# EAGLE design USB-interface-board (EAGLE 7.1.0)
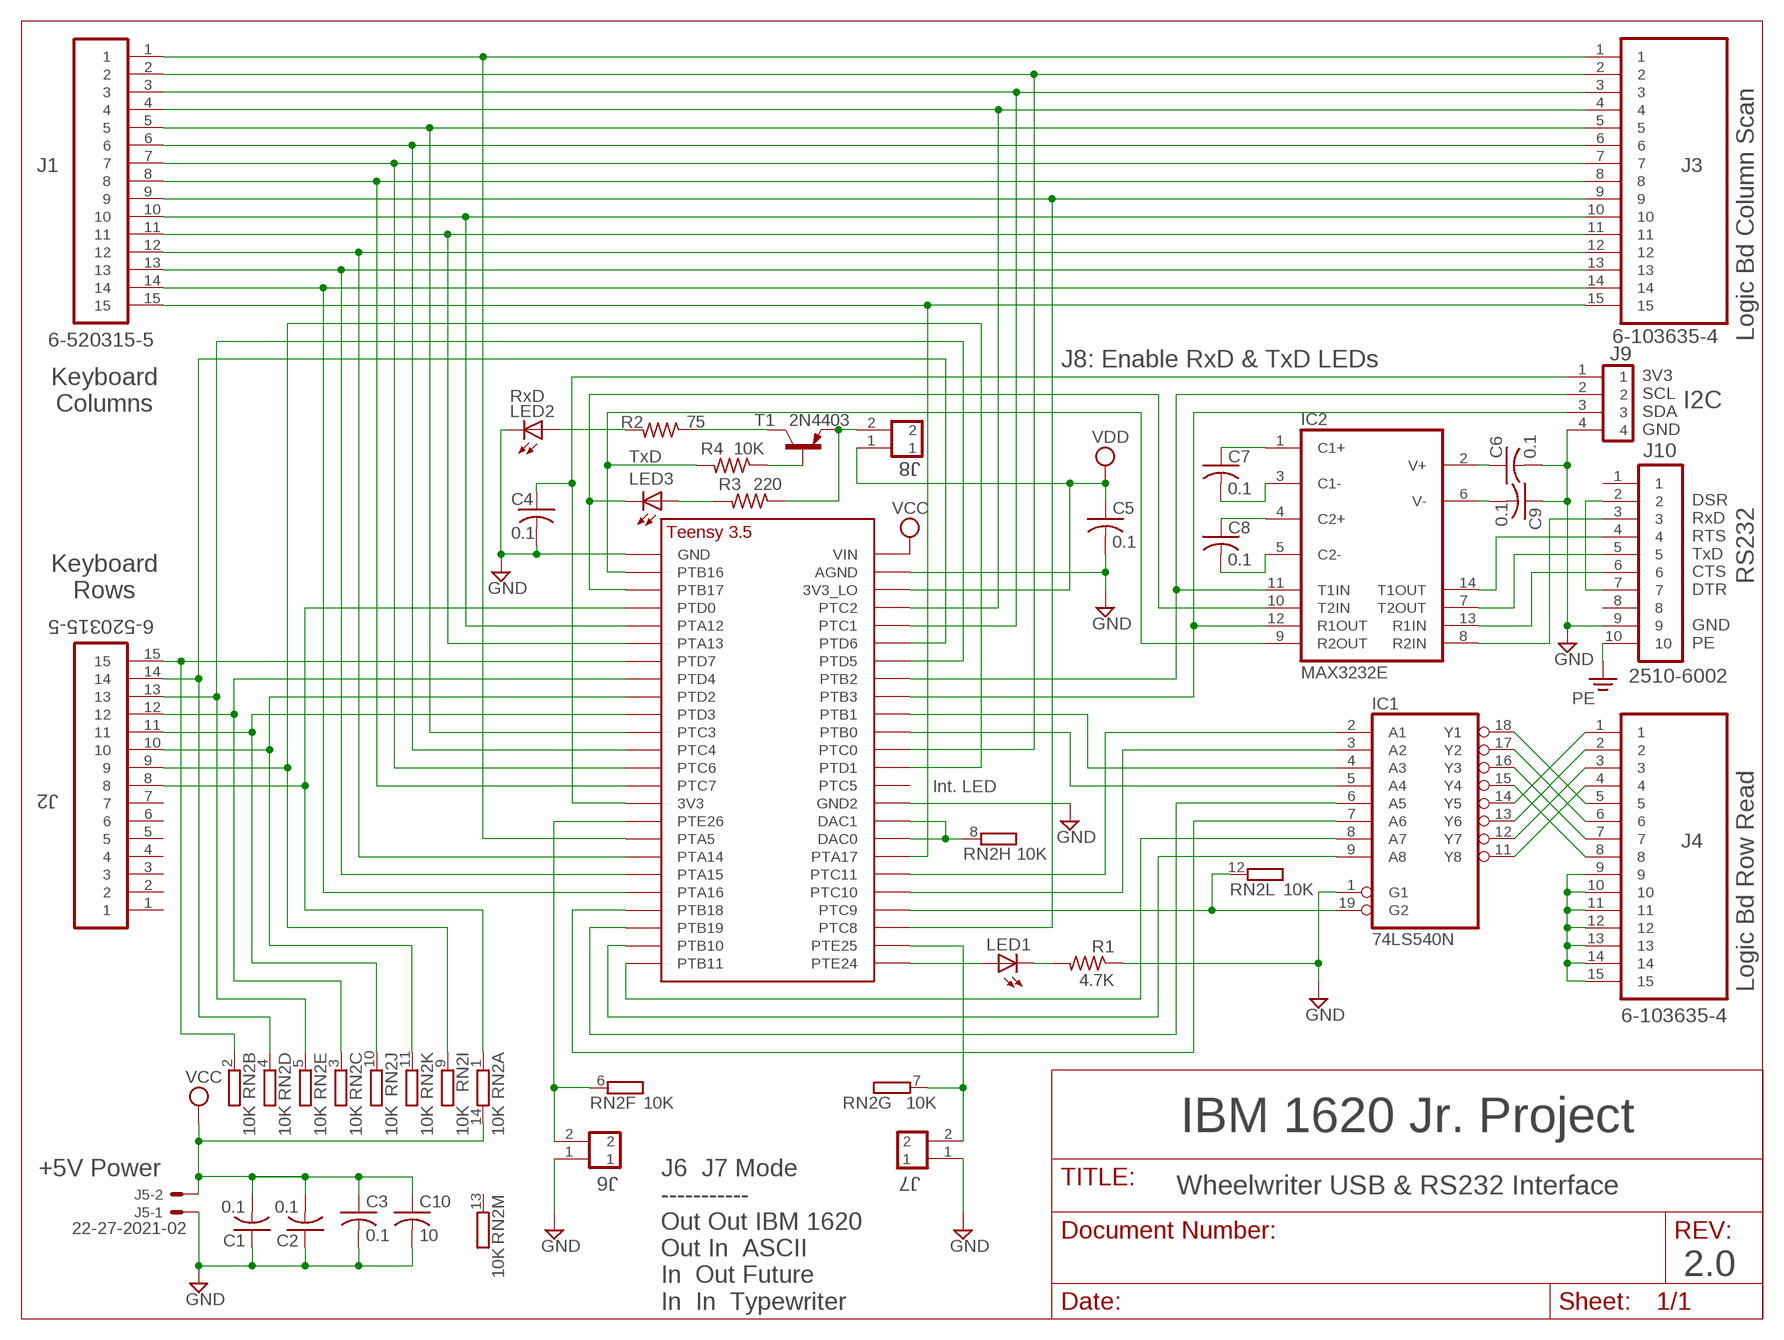
[diagram p0: schematic, sheet 1]

## Parts
C1  0.1  C-US025-025X050  [C025-025X050]
C2  0.1  C-US025-025X050  [C025-025X050]
C3  0.1  C-US025-025X050  [C025-025X050]
C4  0.1  C-US025-025X050  [C025-025X050]
C5  0.1  C-US025-025X050  [C025-025X050]
C6  0.1  C-US025-025X050  [C025-025X050]
C7  0.1  C-US025-025X050  [C025-025X050]
C8  0.1  C-US025-025X050  [C025-025X050]
C9  0.1  C-US025-025X050  [C025-025X050]
C10  10  C-US050-035X075  [C050-035X075]
IC1  74LS540N  [DIL20]
IC2  MAX3232E  MAX3232EPE  [DIL16]
J1  6-520315-5  TYCO-6-520315-5  [6-520315-5]
J2  6-520315-5  TYCO-6-520315-5U  [6-520315-5-U]
J3  6-103635-4  [6-103635-4]
J4  6-103635-4  [6-103635-4]
J5  22-27-2021-02  [6410-02]
J6  HEADER-1X2  [HEADER-1X2]
J7  HEADER-1X2  [HEADER-1X2]
J8  HEADER-1X2  [HEADER-1X2]
J9  HEADER-1X4  [HEADER-1X4]
J10  2510-6002  2510-  [PAK100/2500-10]
LED1  LED3MM  [LED3MM]
LED2  RxD  LED3MM  [LED3MM]
LED3  TxD  LED3MM  [LED3MM]
R1  4.7K  R-US_0204/5  [0204/5]
R2  75  R-US_0204/5  [0204/5]
R3  220  R-US_0204/5  [0204/5]
R4  10K  R-US_0204/5  [0204/5]
RN2  10K  E13R  [DIL14]
T1  2N4403  2N3906  [TO92]
U$1  TEENSY_3.5_BASIC  [TEENSY_3.5_BASIC]

## Nets
GND: C1.1 C2.1 C3.2 C4.2 C5.2 C6.2 C9.1 C10.2 IC1.1(G1) J5.1 J6.1 J7.1 J9.4 J10.9 LED2.K(C) R1.1 U$1.AGND U$1.GND U$1.GND2
N$1: J1.2 J3.2 U$1.PTC0
N$2: J1.3 J3.3 U$1.PTC1
N$3: J1.4 J3.4 U$1.PTC2
N$4: J1.5 J3.5 U$1.PTC3
N$5: J1.6 J3.6 U$1.PTC4
N$6: J1.7 J3.7 U$1.PTC6
N$7: J1.8 J3.8 U$1.PTC7
N$8: J1.9 J3.9 U$1.PTC8
N$9: J1.10 J3.10 U$1.PTA12
N$10: J1.11 J3.11 U$1.PTA13
N$11: J1.12 J3.12 U$1.PTA14
N$12: J1.13 J3.13 U$1.PTA15
N$13: J1.14 J3.14 U$1.PTA16
N$14: J1.15 J3.15 U$1.PTA17
N$15: J2.15 RN2.2 U$1.PTD7
N$16: J2.14 RN2.4 U$1.PTD6
N$17: J2.13 RN2.5 U$1.PTD5
N$18: J2.12 RN2.3 U$1.PTD4
N$19: J2.11 RN2.10 U$1.PTD3
N$20: J2.10 RN2.11 U$1.PTD2
N$21: J2.9 RN2.9 U$1.PTD1
N$22: J2.8 RN2.1 U$1.PTD0
N$23: IC1.11(Y8) J4.4
N$24: IC1.12(Y7) J4.3
N$25: IC1.13(Y6) J4.2
N$26: IC1.14(Y5) J4.1
N$27: IC1.15(Y4) J4.8
N$28: IC1.16(Y3) J4.7
N$29: IC1.17(Y2) J4.6
N$30: IC1.18(Y1) J4.5
N$31: J4.9 J4.10 J4.11 J4.12 J4.13 J4.14 J4.15
N$32: IC1.8(A7) U$1.PTB11
N$33: IC1.9(A8) U$1.PTB10
N$34: IC1.6(A5) U$1.PTB19
N$35: IC1.7(A6) U$1.PTB18
N$36: IC1.5(A4) U$1.PTB0
N$37: IC1.4(A3) U$1.PTB1
N$38: IC1.2(A1) U$1.PTC11
N$39: IC1.3(A2) U$1.PTC10
N$40: J6.2 RN2.6 U$1.PTE26
N$41: C6.1 IC2.2(V+)
N$42: LED1.K(C) R1.2
N$43: LED1.A U$1.PTE24
N$44: J7.2 RN2.7 U$1.PTE25
N$45: C9.2 IC2.6(V-)
N$46: IC2.14(T1OUT) J10.4
N$47: C4.1 J9.1 U$1.3V3
N$48: IC2.12(R1OUT) J9.3 U$1.PTB3
N$49: C7.1 IC2.1(C1+)
N$50: J10.2 J10.7
N$51: IC1.19(G2) RN2.12 U$1.PTC9
N$52: J1.1 J3.1 U$1.PTA5
N$53: C7.2 IC2.3(C1-)
N$54: C8.1 IC2.4(C2+)
N$55: C8.2 IC2.5(C2-)
N$56: IC2.11(T1IN) J9.2 U$1.PTB2
N$57: IC2.9(R2OUT) R4.2 U$1.PTB16
N$58: IC2.10(T2IN) LED3.K(C) U$1.PTB17
N$59: IC2.7(T2OUT) J10.5
N$60: IC2.8(R2IN) J10.3
N$61: IC2.13(R1IN) J10.6
N$62: R2.1 T1.1(C)
N$63: LED3.A R3.2
N$64: LED2.A R2.2
N$65: RN2.8 U$1.DAC0 U$1.DAC1
N$66: J8.2 R3.1 T1.3(E)
N$68: R4.1 T1.2(B)
PE: J10.10
VCC: C1.2 C2.2 C3.1 C10.1 J5.2 RN2.14 U$1.VIN
VDD: C5.1 J8.1 U$1.3V3_LO
Unconnected: J2.1 J2.2 J2.3 J2.4 J2.5 J2.6 J2.7 J10.1 J10.8 RN2.13 U$1.PTC5

## Notes on the sheet
- Logic Bd Column Scan
- Keyboard
  Columns
- J8: Enable RxD & TxD LEDs
- 3V3
  SCL
  SDA
  GND
- I2C
- DSR
  RxD
  RTS
  TxD
  CTS
  DTR
  
  GND
  PE
- RS232
- Keyboard
  Rows
- Int. LED
- Logic Bd Row Read
- IBM 1620 Jr. Project
- J6  J7 Mode
  -----------
  Out Out IBM 1620
  Out In  ASCII
  In  Out Future
  In  In  Typewriter
- +5V Power
- Wheelwriter USB & RS232 Interface
- 2.0

## Power pins joined to a net without a drawn wire
GND: IC1.10(GND) IC2.15(GND)
VCC: IC1.20(VCC)
VDD: IC2.16(VDD)

## Library data of the parts
C1-C10 = Casner:C-US: CAPACITOR, American symbol
IC1 = 74xx-us:74*540: Octal BUFFER and LINE DRIVER, 3-state
IC2 = Casner:MAX3232*: True RS-232 Transceivers 3.0V to 5.5V, Low-Power up to 1Mbps, Using Four 0.1µF External Capacitors Source: http://pdfserv.maxim-ic.com/en/ds/MAX3222-MAX3241.pdf; MPN: MAX3232EPE+; OC_FARNELL: unknown; OC_NEWARK: 67K4860
J1 J2 = Casner:TYCO-6-520315-5: FFC Connector, Vertical, 2.54MM, PCB, 1X15WAY
J3 J4 = Casner:6-103635-4: FFC Crimp Conn, Right Angle, 2.54MM, PCB, 1X15WAY
J5 = con-molex:22-?-02: CONNECTOR wire to board 2.54 mm (.1 inch) pitch header; OC_FARNELL: unknown; OC_NEWARK: unknown
J6-J8 = Casner:HEADER-1X2: CONN HEADER, 2.54MM, PCB, 1X2WAY; MPN: BBS-102-T-A; OC_FARNELL: 1766136; OC_NEWARK: -; PACKAGE: HEADER, 2.54MM, PCB, 1X2WAY; SUPPLIER: SAMTEC
J9 = Casner:HEADER-1X4: CONN HEADER, 2.54MM, PCB, 1X4WAY; MPN: BBS-104-T-A; PACKAGE: HEADER, 2.54MM, PCB, 1X4WAY; SUPPLIER: SAMTEC
J10 = Casner:2510-: 3M (TM) Pak 100 4-Wall Header Source: 3M; MF: 3M; MPN: 2510-6002UB; OC_FARNELL: 9838244; OC_NEWARK: 46F4725
LED1-LED3 = Casner:LED: LED OSRAM: - CHIPLED LG R971, LG N971, LY N971, LG Q971, LY Q971, LO R971, LY R971 LH N974, LH R974 LS Q976, LO Q976, LY Q976 LO Q996 - Hyper CHIPLED LW Q18S LB Q993, LB Q99A, LB R99A - SideLED LS A670, LO A670, LY A670, LG A670, LP A670 LB A673, LV A673, LT A673, LW A673 LH A674 LY A675 LS A676, LA A676, LO A676, LY A676, LW A676 LS A679, LY A679, LG A679 - Hyper Micro SIDELED® LS Y876, LA Y876, LO Y876, LY Y876 LT Y87S - SmartLED LW L88C, LW L88S LB L89C, LB L89S, LG L890 LS L89K, LO L89K, LY L89K LS L896, LA L896, LO L896, LY L896 - TOPLED LS T670, LO T670, LY T670, LG T670, LP T670 LSG T670, LSP T670, LSY T670, LOP T670, LYG T670 LG T671, LOG T671, LSG T671 LB T673, LV T673, LT T673, LW T673 LH T674 LS T676, LA T676, LO T676, LY T676, LB T676, LH T676, LSB T676, LW T676 LB T67C, LV T67C, LT T67C, LS T67K, LO T67K, LY T67K, LW E67C LS E67B, LA E67B, LO E67B, LY E67B, LB E67C, LV E67C, LT E67C LW T67C LS T679, LY T679, LG T679 LS T770, LO T770, LY T770, LG T770, LP T770 LB T773, LV T773, LT T773, LW T773 LH T774 LS E675, LA E675, LY E675, LS T675 LS T776, LA T776, LO T776, LY T776, LB T776 LHGB T686 LT T68C, LB T68C - Hyper Mini TOPLED® LB M676 - Mini TOPLED Santana® LG M470 LS M47K, LO M47K, LY M47K Source: http://www.osram.convergy.de LUXEON: - LUMILED® LXK2-PW12-R00, LXK2-PW12-S00, LXK2-PW14-U00, LXK2-PW14-V00 LXK2-PM12-R00, LXK2-PM12-S00, LXK2-PM14-U00 LXK2-PE12-Q00, LXK2-PE12-R00, LXK2-PE12-S00, LXK2-PE14-T00, LXK2-PE14-U00 LXK2-PB12-K00, LXK2-PB12-L00, LXK2-PB12-M00, LXK2-PB14-N00, LXK2-PB14-P00, LXK2-PB14-Q00 LXK2-PR12-L00, LXK2-PR12-M00, LXK2-PR14-Q00, LXK2-PR14-R00 LXK2-PD12-Q00, LXK2-PD12-R00, LXK2-PD12-S00 LXK2-PH12-R00, LXK2-PH12-S00 LXK2-PL12-P00, LXK2-PL12-Q00, LXK2-PL12-R00 Source: www.luxeon.com KINGBRIGHT: KA-3528ASYC Source: www.kingbright.com
R1-R4 = Casner:R-US_: RESISTOR, American symbol
RN2 = resistor-dil:E13R: DIL RESISTOR; OC_FARNELL: unknown; OC_NEWARK: unknown
T1 = transistor-pnp:2N3906: PNP Transistor
U$1 = Teensy35:TEENSY_3.5_BASIC

## Board
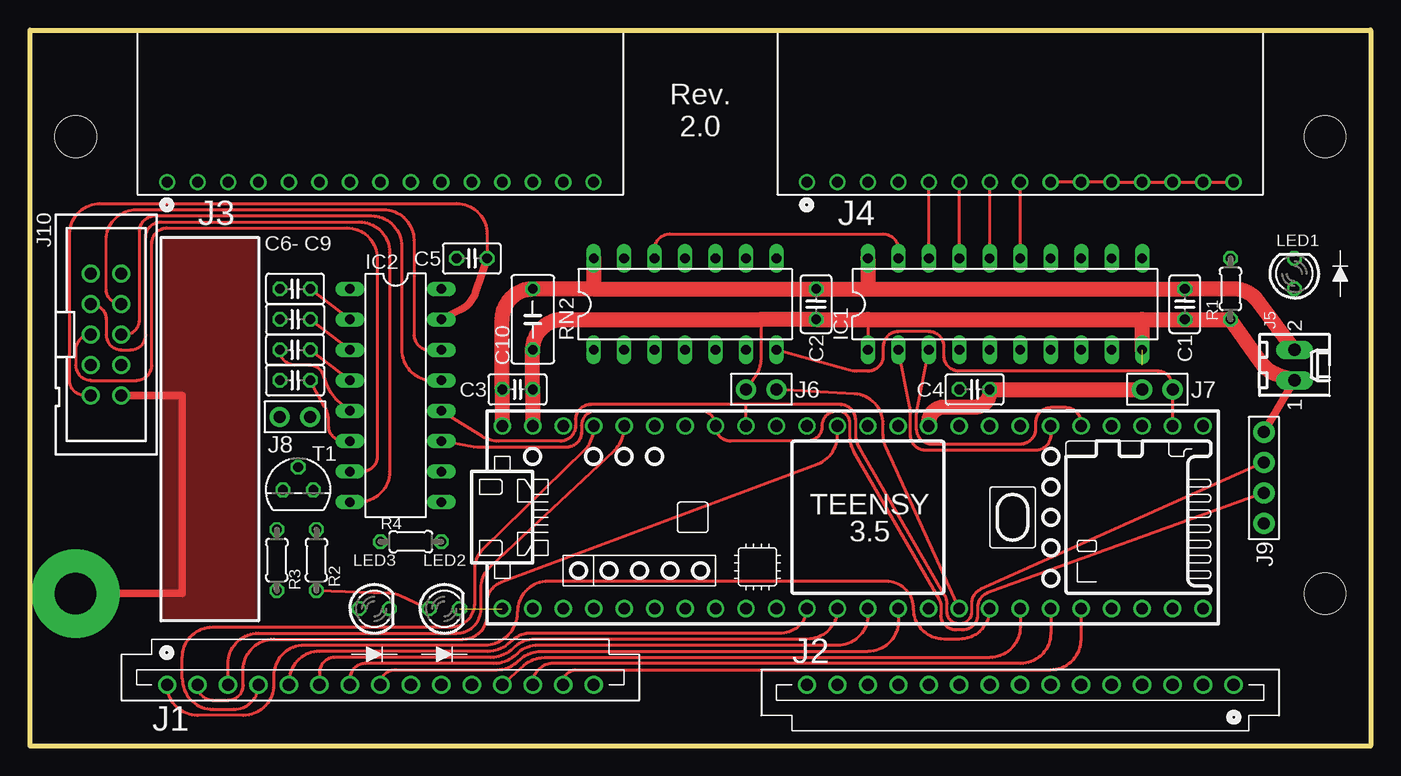
[diagram p1: board, top side]
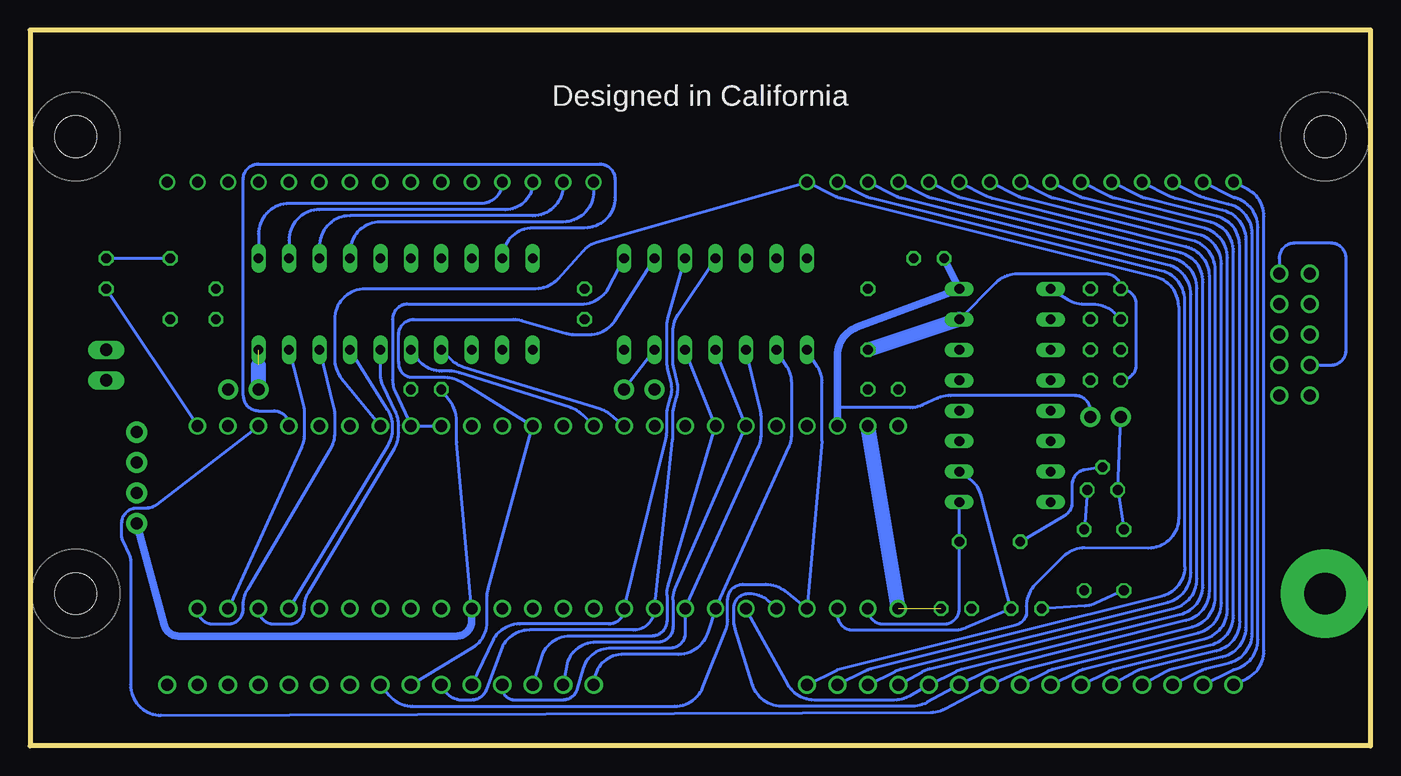
[diagram p2: board, bottom side, seen from below]

Size 111.76 x 59.69 mm. Coordinates in mm from the lower left corner, seen from the top.
Outline: 0,0 0,59.69 111.76,59.69 111.76,0 0,0
Copper layers (1*16): Top 0.0356mm / dielectric 1.5011mm / Bottom 0.0356mm
Design rules "oshpark-2layer": minimum track width 6mil, minimum drill 13mil, track to track 6mil, track to pad 6mil, pad to pad 6mil, via to via 6mil, smd to smd 6mil, copper to edge 15mil, drill to drill 6mil, minimum pad ring 7mil, minimum via ring 7mil, stop-mask expansion 2.5mil, vias tented up to drill 0mil, thermal gap 10mil

### Footprints (pad centres in the part's own frame; a part is rotated, then mirrored left to right if it is on the bottom)
C025-025X050 = drill 0.813 octagon: 1 -1.27,0; 2 1.27,0
C050-035X075 = drill 0.813 octagon: 1 -2.54,0; 2 2.54,0
DIL20 = drill 0.813 long: 1 -11.43,-3.81; 2 -8.89,-3.81; 3 -6.35,-3.81; 4 -3.81,-3.81; 5 -1.27,-3.81; 6 1.27,-3.81; 7 3.81,-3.81; 8 6.35,-3.81; 9 8.89,-3.81; 10 11.43,-3.81; 11 11.43,3.81; 12 8.89,3.81; 13 6.35,3.81; 14 3.81,3.81; 15 1.27,3.81; 16 -1.27,3.81; 17 -3.81,3.81; 18 -6.35,3.81; 19 -8.89,3.81; 20 -11.43,3.81
DIL16 = drill 0.813 long: 1 -8.89,-3.81; 2 -6.35,-3.81; 3 -3.81,-3.81; 4 -1.27,-3.81; 5 1.27,-3.81; 6 3.81,-3.81; 7 6.35,-3.81; 8 8.89,-3.81; 9 8.89,3.81; 10 6.35,3.81; 11 3.81,3.81; 12 1.27,3.81; 13 -1.27,3.81; 14 -3.81,3.81; 15 -6.35,3.81; 16 -8.89,3.81
6-520315-5 = drill 1.016: 1 0,0; 2 2.54,0; 3 5.08,0; 4 7.62,0; 5 10.16,0; 6 12.7,0; 7 15.24,0; 8 17.78,0; 9 20.32,0; 10 22.86,0; 11 25.4,0; 12 27.94,0; 13 30.48,0; 14 33.02,0; 15 35.56,0
6-520315-5-U = drill 1.016: 1 0,0; 2 2.54,0; 3 5.08,0; 4 7.62,0; 5 10.16,0; 6 12.7,0; 7 15.24,0; 8 17.78,0; 9 20.32,0; 10 22.86,0; 11 25.4,0; 12 27.94,0; 13 30.48,0; 14 33.02,0; 15 35.56,0
6-103635-4 = drill 0.9: 1 0,0; 2 2.54,0; 3 5.08,0; 4 7.62,0; 5 10.16,0; 6 12.7,0; 7 15.24,0; 8 17.78,0; 9 20.32,0; 10 22.86,0; 11 25.4,0; 12 27.94,0; 13 30.48,0; 14 33.02,0; 15 35.56,0
6410-02 = drill 1.016 long: 1 1.27,0; 2 -1.27,0
HEADER-1X2 = drill 1 pad 1.676: 1 0,0; 2 2.54,0
HEADER-1X4 = drill 1 pad 1.778: 1 0,0; 2 2.54,0; 3 5.08,0; 4 7.62,0
PAK100/2500-10 = drill 1 pad 1.422: 1 -5.08,-1.27; 2 -5.08,1.27; 3 -2.54,-1.27; 4 -2.54,1.27; 5 0,-1.27; 6 0,1.27; 7 2.54,-1.27; 8 2.54,1.27; 9 5.08,-1.27; 10 5.08,1.27
LED3MM = drill 0.813 octagon: A -1.27,0; K 1.27,0
0204/5 = drill 0.813 octagon: 1 -2.54,0; 2 2.54,0
DIL14 = drill 0.813 long: 1 -7.62,-3.81; 2 -5.08,-3.81; 3 -2.54,-3.81; 4 0,-3.81; 5 2.54,-3.81; 6 5.08,-3.81; 7 7.62,-3.81; 8 7.62,3.81; 9 5.08,3.81; 10 2.54,3.81; 11 0,3.81; 12 -2.54,3.81; 13 -5.08,3.81; 14 -7.62,3.81
TO92 = drill 0.813 octagon: 1 1.27,0; 2 0,1.905; 3 -1.27,0
TEENSY_3.5_BASIC = drill 0.965: 3V3 7.62,-7.62; 3V3_LO -22.86,7.62; AGND -25.4,7.62; DAC0 12.7,7.62; DAC1 10.16,7.62; GND -27.94,-7.62; GND2 7.62,7.62; PTA5 12.7,-7.62; PTA12 -17.78,-7.62; PTA13 -15.24,-7.62; PTA14 15.24,-7.62; PTA15 17.78,-7.62; PTA16 20.32,-7.62; PTA17 15.24,7.62; PTB0 -2.54,7.62; PTB1 -5.08,7.62; PTB2 -10.16,7.62; PTB3 -7.62,7.62; PTB10 27.94,-7.62; PTB11 30.48,-7.62; PTB16 -25.4,-7.62; PTB17 -22.86,-7.62; PTB18 22.86,-7.62; PTB19 25.4,-7.62; PTC0 0,7.62; PTC1 -17.78,7.62; PTC2 -20.32,7.62; PTC3 -2.54,-7.62; PTC4 0,-7.62; PTC5 5.08,7.62; PTC6 2.54,-7.62; PTC7 5.08,-7.62; PTC8 25.4,7.62; PTC9 22.86,7.62; PTC10 20.32,7.62; PTC11 17.78,7.62; PTD0 -20.32,-7.62; PTD1 2.54,7.62; PTD2 -7.62,-7.62; PTD3 -5.08,-7.62; PTD4 -10.16,-7.62; PTD5 -12.7,7.62; PTD6 -15.24,7.62; PTD7 -12.7,-7.62; PTE24 30.48,7.62; PTE25 27.94,7.62; PTE26 10.16,-7.62; VIN -27.94,7.62
MOUNTING_HOLE = hole 3.454: 0,0

### Placement (x,y rotation side)
C1  96.27,36.83 90 top
C2  65.53,36.83 90 top
C3  40.64,29.72 0 top
C4  78.74,29.72 0 top
C5  36.83,40.64 0 top
C6  22.1,38.1 180 top
C7  22.1,35.56 0 top
C8  22.1,33.02 180 top
C9  22.1,30.48 0 top
C10  41.91,35.56 270 top
IC1  81.28,36.83 0 top
IC2  30.48,29.21 270 top
J1  11.43,5.08 0 top
J2  100.33,5.08 180 top
J3  11.43,46.99 0 top
J4  64.77,46.99 0 top
J5  105.41,31.75 270 top
J6  59.69,29.72 0 top
J7  92.71,29.72 0 top
J8  23.37,27.43 180 top
J9  102.87,18.54 90 top
J10  6.35,34.29 270 top
LED1  105.41,39.37 90 top
LED2  34.54,11.43 0 top
LED3  28.7,11.43 0 top
R1  100.08,38.1 90 top
R2  23.88,15.49 270 top
R3  20.57,15.49 270 top
R4  31.75,17.02 0 top
RN2  54.61,36.83 0 top
T1  22.35,21.34 0 top
U$1  67.31,19.05 0 top
U$2  [MOUNTING_HOLE]  3.81,50.8 0 top
U$4  [MOUNTING_HOLE]  107.95,50.8 0 top
U$5  [MOUNTING_HOLE]  107.95,12.7 0 top

### Tracks (layer width: path | path; a pad name or v marks a point on that pad's centre or on a via)
GND  (2 unrouted)
  Top 0.254: J6.1 60.49,30.83 arc36 60.96,32.31 60.96,35.56 | J10.9 4.57,29.21 arc-90 3.3,30.48 3.3,42.67 arc-90 5.84,45.21 35.56,45.21 arc-90 38.1,42.67 C5.2 | 69.85,35.56 IC1.1
  Top 0.61: J5.1 J9.4 | C5.2 37.16,37.83 arc-45 35.89,36.36 IC2.15
  Top 1.27: 92.71,35.56 69.85,35.56 C2.1 60.96,35.56 44.45,35.56 arc90 C10.2 C3.2 U$1.AGND | 92.71,35.56 C1.1 R1.1 102.64,31.92 arc36 103.91,30.98 J5.1 | IC1.10 92.71,35.56 | J7.1 C4.2 80.01,29.52 arc-90 78.74,28.25 76.2,28.25 arc90 74.93,26.98 U$1.GND2
  Bottom 0.254: IC2.15 31.22,38.63 arc45 29.43,39.37 22.1,39.37 arc90 C6.2 arc90 19.56,36.83 19.56,31.75 arc90 C9.1
  Bottom 1.27: U$1.GND U$1.AGND | J7.1 92.71,31.75 | IC2.15 C10.2
N$1
  Top 0.254: J1.2 arc90 15.24,3.81 16.51,3.81 arc90 17.78,5.08 17.78,6.35 arc-90 20.32,8.89 36.1,8.89 arc95 38.1,11.05 38.1,12.13 arc-66 39.4,13.69 65.66,23.51 arc69 67.31,25.89 U$1.PTC0
  Bottom 0.254: J1.2 11.53,6.3 arc13 11.32,6.38 arc-76 9.4,8.84 9.4,43.23 arc-76 11.32,45.69 arc13 11.53,45.77 J3.2
N$2
  Top 0.254: J1.3 16.51,6.86 arc-90 19.05,9.4 35.59,9.4 arc90 37.59,11.4 37.59,13.12 arc-47 38.4,14.98 48.73,24.65 arc47 49.53,26.5 U$1.PTC1
  Bottom 0.254: J3.3 14.22,45.84 arc-13 13.7,45.65 11.83,45.19 arc76 9.91,42.72 9.91,9.35 arc76 11.83,6.88 13.7,6.42 arc-13 14.22,6.22 J1.3
N$3
  Top 0.254: J1.4 arc-90 17.02,3.05 15.24,3.05 arc-90 12.7,5.59 12.7,7.37 arc-90 15.24,9.91 35.08,9.91 arc90 37.08,11.91 37.08,14.68 arc-46 37.85,16.5 46.22,24.65 arc46 46.99,26.47 U$1.PTC2
  Bottom 0.254: J3.4 16.76,45.84 arc-13 16.24,45.65 12.34,44.68 arc76 10.41,42.21 10.41,9.88 arc77 12.36,7.41 16.43,6.43 arc-16 17.07,6.18 J1.4
N$4
  Top 0.254: U$1.PTC3 arc-90 62.48,9.4 41.83,9.4 arc41 40.18,8.79 39.83,8.48 arc-41 38.18,7.87 24.13,7.87 arc90 21.59,5.33 J1.5
  Bottom 0.254: J3.5 19.3,45.84 arc-13 18.78,45.65 12.85,44.17 arc76 10.92,41.7 10.92,10.38 arc76 12.86,7.91 18.97,6.43 arc-15 19.61,6.18 J1.5
N$5
  Top 0.254: U$1.PTC4 arc-90 64.77,8.89 42.09,8.89 arc41 40.43,8.28 40.08,7.98 arc-41 38.43,7.37 25.4,7.37 arc90 24.13,6.1 J1.6
  Bottom 0.254: J1.6 21.84,6.22 arc13 21.32,6.42 13.35,8.41 arc-76 11.43,10.87 11.43,41.2 arc-76 13.35,43.66 21.32,45.65 arc13 21.84,45.84 J3.6
N$6
  Top 0.254: U$1.PTC6 69.85,10.92 arc-90 67.31,8.38 42.34,8.38 arc41 40.69,7.77 40.34,7.47 arc-41 38.68,6.86 27.94,6.86 arc90 26.67,5.59 J1.7
  Bottom 0.254: J1.7 24.38,6.22 arc13 23.86,6.42 13.86,8.92 arc-76 11.94,11.38 11.94,40.69 arc-76 13.86,43.15 23.86,45.65 arc13 24.38,45.84 J3.7
N$7
  Top 0.254: U$1.PTC7 72.39,10.41 arc-90 69.85,7.87 42.6,7.87 arc41 40.94,7.26 40.59,6.96 arc-41 38.94,6.35 30.48,6.35 arc90 J1.8
  Bottom 0.254: J1.8 26.92,6.22 arc13 26.4,6.42 14.37,9.43 arc-76 12.45,11.89 12.45,40.18 arc-76 14.37,42.65 26.4,45.65 arc13 26.92,45.84 J3.8
N$8
  Bottom 0.254: J3.9 29.46,45.84 arc-13 28.94,45.65 14.88,42.14 arc76 12.95,39.67 12.95,12.39 arc76 14.87,9.93 28.74,6.41 arc-10 29.16,6.26 J1.9 35.48,3.09 arc28 36.67,2.79 100.83,2.55 arc90 103.38,5.09 103.38,15.45 arc-27 103.51,16.02 104.01,17 arc27 104.14,17.57 104.14,18.54 arc90 102.87,19.81 102.03,19.81 arc-38 101.26,20.08 U$1.PTC8
N$9
  Bottom 0.254: J3.10 32,45.84 arc-13 31.48,45.65 15.39,41.63 arc76 13.46,39.16 13.46,12.9 arc76 15.39,10.44 31.48,6.42 arc-13 32,6.22 J1.10 36.98,3.61 arc29 38.2,3.3 49.1,3.3 arc73 51.53,5.09 52.97,9.79 arc17 53.09,10.54 53.09,11.47 arc90 51.85,12.7 arc45 50.06,11.96 U$1.PTA12
N$10
  Bottom 0.254: J3.11 34.54,45.84 arc-13 34.02,45.65 15.89,41.12 arc76 13.97,38.66 13.97,13.41 arc76 15.89,10.95 34.02,6.42 arc-13 34.54,6.22 J1.11 38.47,4.14 arc30 39.73,3.81 46.37,3.81 arc61 48.59,5.12 U$1.PTA13
N$11
  Top 0.254: U$1.PTA14 82.55,9.91 arc-90 80.01,7.37 42.88,7.37 arc42 41.19,6.71 J1.12
  Bottom 0.254: J1.12 37.38,6.19 arc15 36.76,6.43 16.41,11.46 arc-76 14.48,13.93 14.48,38.15 arc-76 16.4,40.61 36.56,45.65 arc13 37.08,45.84 J3.12
N$12
  Top 0.254: U$1.PTA15 85.09,9.4 arc-90 82.55,6.86 43.43,6.86 arc90 J1.13
  Bottom 0.254: J1.13 39.62,6.22 arc13 39.1,6.42 16.91,11.96 arc-76 14.99,14.43 14.99,37.64 arc-76 16.91,40.1 39.1,45.65 arc13 39.62,45.84 J3.13
N$13
  Top 0.254: J1.14 arc-90 45.47,6.35 85.09,6.35 arc90 87.63,8.89 U$1.PTA16
  Bottom 0.254: J3.14 42.16,45.84 arc-13 41.64,45.65 17.42,39.6 arc76 15.49,37.13 15.49,14.94 arc76 17.42,12.47 41.64,6.42 arc-13 42.16,6.22 J1.14
N$14
  Bottom 0.254: J1.15 44.45,6.35 29.61,10.06 arc-59 28.7,10.92 28.7,11.65 arc45 27.96,13.44 25.64,15.76 arc45 23.83,16.5 18.56,16.48 arc-90 16,19.02 16,36.62 arc-76 17.93,39.09 44.18,45.65 arc13 44.7,45.84 J3.15 64.53,42 arc-29 65.61,41.29 67.75,38.93 arc48 69.63,38.1 83.82,38.1 arc-90 86.36,35.56 86.36,32.23 arc-39 85.79,30.62 U$1.PTA17
N$15
  Bottom 0.254: J2.15 64.62,5.95 arc70 62.49,7.62 57.71,7.62 arc-72 55.3,9.36 U$1.PTD7 48.49,24.9 arc-24 48.26,25.95 48.26,30.26 arc-32 48.65,31.61 RN2.2
N$16
  Bottom 0.254: J2.14 66.94,7.05 arc68 64.58,8.64 59.44,8.64 arc-90 58.17,9.91 58.17,12.17 arc24 57.95,13.19 U$1.PTD6 RN2.4
N$17
  Bottom 0.254: J2.13 69.02,7.7 arc64 66.73,9.14 59.94,9.14 arc-90 58.67,10.41 58.67,12.59 arc17 58.57,13.31 U$1.PTD5 RN2.5
N$18
  Bottom 0.254: J2.12 72.26,4.38 arc-56 71.45,3.81 67.36,3.81 arc-74 66.14,4.73 65.64,6.48 arc69 63.52,8.13 58.42,8.13 arc-90 57.15,9.4 U$1.PTD4 51.03,24.9 arc-24 50.8,25.95 50.8,27.39 arc-13 50.87,27.98 RN2.3
N$19
  Bottom 0.254: J2.11 73.12,8.9 arc60 70.93,10.16 63.5,10.16 arc-90 U$1.PTD3 58.75,25.61 arc-14 58.67,26.21 58.67,27.58 arc16 58.58,28.28 58.35,29.06 arc-30 58.33,30.38 58.6,31.45 arc14 58.67,32.06 58.67,34.95 arc16 58.58,35.65 RN2.10
N$20
  Bottom 0.254: J2.10 arc-56 76,3.81 74.94,3.81 arc-69 73.75,4.63 72.35,8.33 arc61 70.12,9.65 61.47,9.65 arc-90 U$1.PTD2 58.18,25.52 arc-6 58.17,25.79 58.17,27.58 arc16 58.07,28.28 57.84,29.06 arc-30 57.82,30.38 58.09,31.45 arc14 58.17,32.06 58.17,34.54 arc34 57.74,35.95 RN2.11
N$21
  Bottom 0.254: RN2.9 63,35.46 arc57 65.14,34.29 66.32,34.29 arc16 67.02,34.39 70.78,35.46 arc-16 71.48,35.56 79.76,35.56 arc-90 81.03,34.29 81.03,32 arc-90 80.01,30.73 77.17,30.73 arc32 75.84,30.36 U$1.PTD1 73.57,13.03 arc-15 73.66,12.36 73.66,10.33 arc59 74.89,8.15 J2.9
N$22
  Bottom 0.254: J2.8 81.8,4.2 arc-50 79.87,3.3 58.02,3.3 arc-68 55.66,4.9 53.71,9.79 arc-17 53.59,10.54 53.59,12.19 arc90 52.32,13.46 50.42,13.46 arc39 48.83,12.9 U$1.PTD0 45.72,25.4 45.72,30.26 arc-32 46.11,31.61 RN2.1
N$23
  Bottom 0.254: J4.4 arc90 74.17,45.21 90.17,45.21 arc-90 92.71,42.67 IC1.11
N$24
  Bottom 0.254: J4.3 arc90 72.14,44.7 87.63,44.7 arc-90 90.17,42.16 IC1.12
N$25
  Bottom 0.254: J4.2 67.31,46.74 arc90 69.85,44.2 85.09,44.2 arc-90 87.63,41.66 IC1.13
N$26
  Bottom 0.254: J4.1 64.77,46.23 arc90 67.31,43.69 82.55,43.69 arc-90 85.09,41.15 IC1.14
N$27
  Top 0.254: IC1.15 J4.8
N$28
  Top 0.254: IC1.16 J4.7
N$29
  Top 0.254: IC1.17 J4.6
N$30
  Top 0.254: IC1.18 J4.5
N$31
  Top 0.254: J4.9 J4.10 J4.11 J4.12 J4.13 J4.14 J4.15
N$32
  Bottom 0.254: U$1.PTB11 arc-90 96.52,10.16 95.25,10.16 arc-90 93.98,11.43 93.98,11.75 arc30 93.63,13.04 86.71,24.8 arc-30 86.36,26.09 86.36,27.57 arc-14 86.43,28.18 IC1.8
N$33
  Bottom 0.254: U$1.PTB10 89.13,24.9 arc-24 88.9,25.95 88.9,27.81 arc-15 88.98,28.45 IC1.9
N$34
  Bottom 0.254: U$1.PTB19 arc-90 91.44,10.16 90.17,10.16 arc-90 88.9,11.43 88.9,11.49 arc31 88.54,12.79 81.38,24.8 arc-31 81.03,26.1 81.03,26.74 arc-26 81.28,27.84 82.3,29.96 arc26 82.55,31.06 IC1.6
N$35
  Bottom 0.254: U$1.PTB18 81.9,25.05 arc-31 81.53,26.36 81.53,26.66 arc-32 81.93,28.02 IC1.7
N$36
  Bottom 0.254: U$1.PTB0 65.68,27.58 arc-28 66.71,28.2 76.01,31.12 arc-17 76.77,31.24 77.43,31.24 arc54 79.5,32.31 IC1.5
N$37
  Bottom 0.254: U$1.PTB1 63.36,27.61 arc-23 64.24,28.09 75.59,31.57 arc28 76.65,32.2 IC1.4
N$38
  Top 0.254: U$1.PTC11 85.09,25.91 arc-90 83.82,24.64 74.68,24.64 arc-90 73.41,25.91 73.41,27.69 arc11 73.36,28.19 IC1.2
N$39
  Top 0.254: U$1.PTC10 87.63,26.92 arc90 86.36,28.19 85.09,28.19 arc90 83.82,26.92 83.82,26.42 arc-90 82.55,25.15 75.18,25.15 arc-90 73.91,26.42 73.91,27.69 arc-11 73.96,28.19 IC1.3
N$40
  Top 0.254: U$1.PTE26 71.35,24.9 arc-24 71.12,25.95 71.12,26.81 arc87 68.73,29.35 J6.2
  Bottom 0.254: RN2.6 J6.2
N$41
  Top 0.254: C6.1 IC2.2
N$42
  Bottom 0.254: R1.2 LED1.K
N$43
  Bottom 0.254: U$1.PTE24 LED1.A
N$44
  Top 0.254: U$1.PTE25 J7.2 95.25,29.97 arc90 93.98,31.24 77.47,31.24 arc-90 76.2,32.51 76.2,33.27 arc90 74.93,34.54 72.39,34.54 arc90 71.12,33.27 71.12,32.51 arc-90 69.85,31.24 68.93,31.24 arc-16 68.24,31.34 RN2.7
N$45
  Top 0.254: IC2.6 26.16,25.4 arc-90 24.89,26.67 24.89,27.04 arc29 24.58,28.25 C9.2
N$46
  Top 0.254: J10.4 arc-90 6.35,38.1 6.35,42.16 arc-90 8.89,44.7 29.46,44.7 arc-90 32,42.16 32,34.29 arc90 33.27,33.02 IC2.14
N$47
  Bottom 0.254: U$1.3V3 76.19,25.29 arc5 76.2,25.52 76.2,27.13 arc-36 76.67,28.6 C4.1
  Bottom 0.61: U$1.3V3 74.93,10.41 arc90 76.2,9.14 99.36,9.14 arc75 100.58,10.08 J9.1
N$48
  Top 0.254: U$1.PTB3 59.69,28.45 | 59.69,28.45 46.74,28.45 arc90 45.47,27.18 45.47,26.67 arc-90 44.2,25.4 39.08,25.4 arc-32 37.74,25.79 IC2.12 | J9.3 79.24,13.04 arc66 78.49,11.88 78.49,11.16 arc-90 77.49,10.16 77.45,10.16 arc-90 76.45,11.16 76.45,11.85 arc30 76.28,12.49 69.17,24.81 arc-30 68.83,26.08 68.83,27.18 arc90 67.56,28.45 59.69,28.45
N$49
  Bottom 0.254: IC2.1 25.26,37.22 arc-32 23.91,36.83 23.15,36.83 arc45 21.35,36.09 C7.1
N$50
  Bottom 0.254: J10.7 3.3,31.75 arc-90 2.03,33.02 2.03,40.64 arc-90 3.3,41.91 6.35,41.91 arc-90 7.62,40.64 J10.2
N$51
  Top 0.254: RN2.12 52.07,41.4 arc-90 53.34,42.67 71.12,42.67 arc-90 72.39,41.4 IC1.19
  Bottom 0.254: U$1.PTC9 arc-90 91.44,27.94 92.71,27.94 arc90 93.98,29.21 93.98,47.24 arc90 92.71,48.51 64.26,48.51 arc90 62.99,47.24 62.99,45.72 arc90 65.53,43.18 69.85,43.18 arc-90 IC1.19
N$52
  Top 0.254: J1.1 arc90 13.97,2.54 17.78,2.54 arc90 20.32,5.08 20.32,5.84 arc-90 22.86,8.38 37.92,8.38 arc41 39.57,8.99 39.75,9.15 arc49 40.64,11.07 40.64,11.18 arc-90 43.18,13.72 71.37,13.72 arc-90 73.66,11.43 arc90 76.2,8.89 77.47,8.89 arc90 U$1.PTA5
  Bottom 0.254: J1.1 10.29,5.65 arc-63 8.89,7.92 8.89,44.15 arc-63 10.29,46.42 J3.1
N$53
  Top 0.254: C7.2 IC2.3
N$54
  Top 0.254: C8.1 IC2.4
N$55
  Top 0.254: IC2.5 25.64,28.8 arc-28 24.91,29.81 24.45,30.95 arc68 23.27,31.75 22.1,31.75 arc-90 C8.2
N$56
  Top 0.254: IC2.11 36.99,24.9 arc4 37.94,24.89 44.7,24.89 arc90 45.97,26.16 45.97,26.67 arc-90 47.24,27.94 55.88,27.94 arc-90 U$1.PTB2 arc90 58.42,25.4 64.77,25.4 arc90 66.04,26.67 arc-90 67.31,27.94 arc-90 68.33,26.92 68.33,25.83 arc30 68.67,24.56 75.78,12.23 arc-30 75.95,11.6 75.95,10.92 arc90 77.22,9.65 77.72,9.65 arc90 78.99,10.92 78.99,11.55 arc-70 79.83,12.75 J9.2
N$57
  Bottom 0.254: U$1.PTB16 arc-90 40.64,10.16 35.56,10.16 arc-90 34.29,11.43 R4.2 IC2.9
N$58
  Bottom 0.254: U$1.PTB17 44.45,10.92 arc-90 43.18,9.65 34.73,9.65 arc-23 33.75,9.85 LED3.K 32.37,20.48 arc-47 33.42,22.24 IC2.10
N$59
  Top 0.254: J10.5 arc90 3.81,33.02 3.81,31.75 arc90 5.08,30.48 8.89,30.48 arc90 10.16,31.75 10.16,41.91 arc-90 11.43,43.18 26.42,43.18 arc-90 28.96,40.64 28.96,24.13 arc-90 27.69,22.86 IC2.7
N$60
  Top 0.254: J10.3 arc-90 6.35,35.56 6.35,34.29 arc90 7.62,33.02 8.38,33.02 arc90 9.65,34.29 9.65,42.42 arc-90 10.92,43.69 27.43,43.69 arc-90 29.97,41.15 29.97,22.86 arc-90 27.43,20.32 IC2.8
N$61
  Top 0.254: J10.6 7.87,34.29 arc90 9.14,35.56 9.14,42.93 arc-90 10.41,44.2 28.45,44.2 arc-90 30.99,41.66 30.99,33.02 arc90 33.53,30.48 IC2.13
N$62
  Bottom 0.254: T1.1 R2.1
N$63
  Bottom 0.254: R3.2 22.94,11.88 arc21 23.84,11.65 LED3.A
N$64
  Top 0.254: R2.2 29.87,12.76 arc-23 30.84,12.54 LED2.A
N$65
  Bottom 0.254: RN2.8 63.55,38.17 arc62 65.79,36.83 80.26,36.83 arc-90 81.53,35.56 81.53,30.53 arc-25 81.3,29.46 U$1.DAC0 U$1.DAC1
N$66
  Bottom 0.254: R3.1 T1.3 J8.2
N$68
  Bottom 0.254: T1.2 23.81,23.02 arc-81 24.89,21.77 24.89,20.28 arc60 25.52,19.19 R4.1
PE  (via drill 3.45 pad 7.37)
  Top 0.61: J10.10 12.7,29.21 12.7,12.7 v3.81,12.7
  pour Top: 10.92,10.41 10.92,42.42 19.05,42.42 19.05,10.41
VCC
  Top 1.27: 69.85,38.1 C2.2 46.99,38.1 | 69.85,38.1 C1.2 100.33,38.1 arc-53 102.36,37.08 J5.2 | IC1.20 69.85,38.1 | RN2.14 46.99,38.1 | 46.99,38.1 C10.1 arc90 39.37,35.56 C3.1 U$1.VIN
VDD
  Bottom 0.254: J8.1 23.37,27.94 arc-90 24.64,29.21 35.02,29.21 arc-24 36.05,28.99 37.35,28.41 arc24 38.38,28.19 44.45,28.19
  Bottom 0.61: C5.1 IC2.16 42.8,34.91 arc-69 44.45,32.53 44.45,28.19 U$1.3V3_LO

### Text on the board
tNames: Rev. / 2.0 | -
bNames: Designed in California
tValues: Or 6-520314-5/6-520315-5 | Or 6-520314-5/6-520315-5 | DSR | RxD | RxD | RTS | TxD | TxD | CTS | DTR | DTR | +5 | GND | GND | GND | PE | GND | UART / RS232 | SDA | SCL | 3V3
bValues: DSR | DSR-DTR Loopback | RxD | RTS | TxD | CTS | +5 | DTR | GND | GND | PE
tStop: IBM 1620 Jr. Project / CHM 2019 Wheelwriter / USB & RS232 Interface | .
bStop: |